# Altium schematic sheet Licznik_sekund.SchDoc
size A4; SheetNumber: 2; SheetTotal: 8
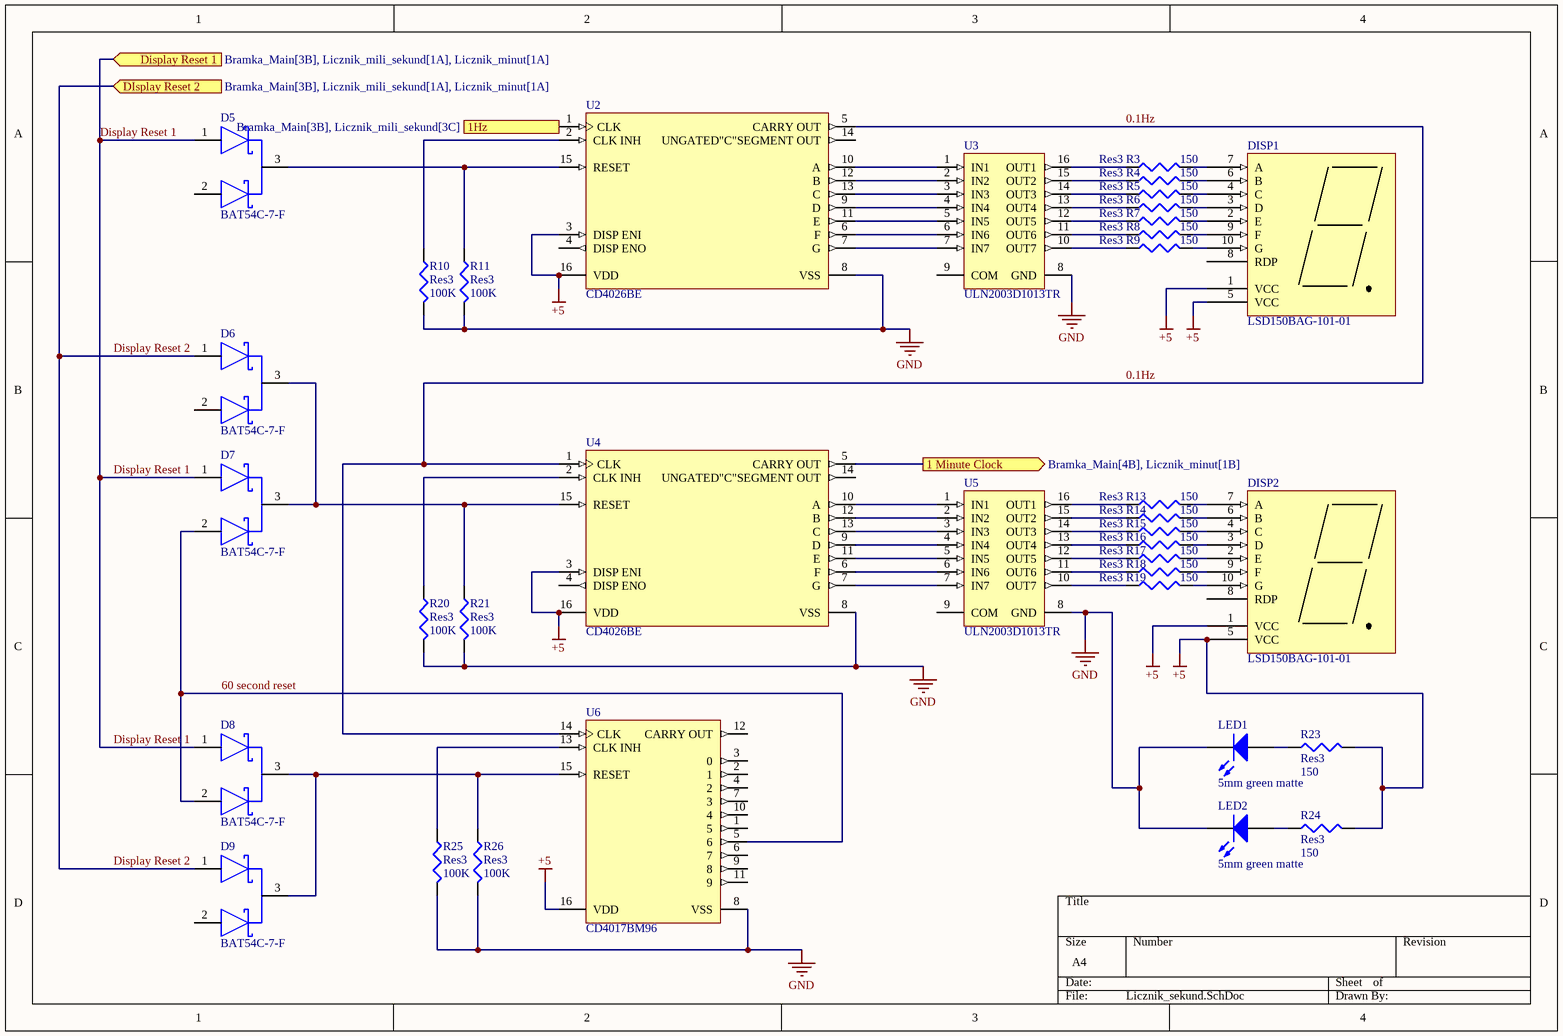
[diagram p0: Licznik_sekund.SchDoc]

## Parts
D5  BAT54C-7-F  [FP-SOT23-IPC_B]
D6  BAT54C-7-F  [FP-SOT23-IPC_B]
D7  BAT54C-7-F  [FP-SOT23-IPC_B]
D8  BAT54C-7-F  [FP-SOT23-IPC_B]
D9  BAT54C-7-F  [FP-SOT23-IPC_B]
DISP1  LSD150BAG-101-01  [7 segment display]
DISP2  LSD150BAG-101-01  [7 segment display]
LED1  5mm green matte  [Type 5mm]
LED2  5mm green matte  [Type 5mm]
R3  Res3  value 150  [6-0805_M]
R4  Res3  value 150  [6-0805_M]
R5  Res3  value 150  [6-0805_M]
R6  Res3  value 150  [6-0805_M]
R7  Res3  value 150  [6-0805_M]
R8  Res3  value 150  [6-0805_M]
R9  Res3  value 150  [6-0805_M]
R10  Res3  value 100K  [J1-0603]
R11  Res3  value 100K  [J1-0603]
R13  Res3  value 150  [6-0805_M]
R14  Res3  value 150  [6-0805_M]
R15  Res3  value 150  [6-0805_M]
R16  Res3  value 150  [6-0805_M]
R17  Res3  value 150  [6-0805_M]
R18  Res3  value 150  [6-0805_M]
R19  Res3  value 150  [6-0805_M]
R20  Res3  value 100K  [J1-0603]
R21  Res3  value 100K  [J1-0603]
R23  Res3  value 150  [6-0805_M]
R24  Res3  value 150  [6-0805_M]
R25  Res3  value 100K  [J1-0603]
R26  Res3  value 100K  [J1-0603]
U2  CD4026BE  [N0016A]
U3  ULN2003D1013TR  [STM-SO-16_M]
U4  CD4026BE  [N0016A]
U5  ULN2003D1013TR  [STM-SO-16_M]
U6  CD4017BM96  [D0016A_L]

## Ports
1 Minute Clock (out, see Bramka_Main[4B], Licznik_minut[1B]), 1Hz (in, see Bramka_Main[3B], Licznik_mili_sekund[3C]), Display Reset 1 (in, see Bramka_Main[3B], Licznik_mili_sekund[1A], Licznik_minut[1A]), DIsplay Reset 2 (in, see Bramka_Main[3B], Licznik_mili_sekund[1A], Licznik_minut[1A])

## Nets
+5: DISP1.1(VCC) DISP1.5(VCC) DISP2.1(VCC) DISP2.5(VCC) R23.2 R24.2 U2.3(DISP_ENI) U2.16(VDD) U4.3(DISP_ENI) U4.16(VDD) U6.16(VDD)
GND: LED1.1(K) LED2.1(K) R10.2 R11.2 R20.2 R21.2 R25.2 R26.2 U2.8(VSS) U3.8(GND) U4.8(VSS) U5.8(GND) U6.8(VSS)
0.1Hz: U2.5(CARRY_OUT) U4.1(CLK) U6.14(CLK)
1 Minute Clock: U4.5(CARRY_OUT) ; port 1 Minute Clock
1Hz: U2.1(CLK) ; port 1Hz
60 second reset: D7.2(2_ANODE) D8.2(2_ANODE) U6.5(6)
Display Reset 1: D5.1(1_ANODE) D7.1(1_ANODE) D8.1(1_ANODE) ; port Display Reset 1
Display Reset 2: D6.1(1_ANODE) D9.1(1_ANODE) ; port DIsplay Reset 2
NetD5_3: D5.3(COMMON_CATHODE) R11.1 U2.15(RESET)
NetD6_3: D6.3(COMMON_CATHODE) D7.3(COMMON_CATHODE) R21.1 U4.15(RESET)
NetD8_3: D8.3(COMMON_CATHODE) D9.3(COMMON_CATHODE) R26.1 U6.15(RESET)
NetDISP1_2: DISP1.2(E) R7.2
NetDISP1_3: DISP1.3(D) R6.2
NetDISP1_4: DISP1.4(C) R5.2
NetDISP1_6: DISP1.6(B) R4.2
NetDISP1_7: DISP1.7(A) R3.2
NetDISP1_9: DISP1.9(F) R8.2
NetDISP1_10: DISP1.10(G) R9.2
NetDISP2_2: DISP2.2(E) R17.2
NetDISP2_3: DISP2.3(D) R16.2
NetDISP2_4: DISP2.4(C) R15.2
NetDISP2_6: DISP2.6(B) R14.2
NetDISP2_7: DISP2.7(A) R13.2
NetDISP2_9: DISP2.9(F) R18.2
NetDISP2_10: DISP2.10(G) R19.2
NetLED1_2: LED1.2(A) R23.1
NetLED2_2: LED2.2(A) R24.1
NetR3_1: R3.1 U3.16(OUT1)
NetR4_1: R4.1 U3.15(OUT2)
NetR5_1: R5.1 U3.14(OUT3)
NetR6_1: R6.1 U3.13(OUT4)
NetR7_1: R7.1 U3.12(OUT5)
NetR8_1: R8.1 U3.11(OUT6)
NetR9_1: R9.1 U3.10(OUT7)
NetR10_1: R10.1 U2.2(CLK_INH)
NetR13_1: R13.1 U5.16(OUT1)
NetR14_1: R14.1 U5.15(OUT2)
NetR15_1: R15.1 U5.14(OUT3)
NetR16_1: R16.1 U5.13(OUT4)
NetR17_1: R17.1 U5.12(OUT5)
NetR18_1: R18.1 U5.11(OUT6)
NetR19_1: R19.1 U5.10(OUT7)
NetR20_1: R20.1 U4.2(CLK_INH)
NetR25_1: R25.1 U6.13(CLK_INH)
NetU2_6: U2.6(F) U3.6(IN6)
NetU2_7: U2.7(G) U3.7(IN7)
NetU2_9: U2.9(D) U3.4(IN4)
NetU2_10: U2.10(A) U3.1(IN1)
NetU2_11: U2.11(E) U3.5(IN5)
NetU2_12: U2.12(B) U3.2(IN2)
NetU2_13: U2.13(C) U3.3(IN3)
NetU4_6: U4.6(F) U5.6(IN6)
NetU4_7: U4.7(G) U5.7(IN7)
NetU4_9: U4.9(D) U5.4(IN4)
NetU4_10: U4.10(A) U5.1(IN1)
NetU4_11: U4.11(E) U5.5(IN5)
NetU4_12: U4.12(B) U5.2(IN2)
NetU4_13: U4.13(C) U5.3(IN3)

Not connected (* = marked no-connect by the designer): D5 2(2_ANODE); D6 2(2_ANODE); D9 2(2_ANODE); DISP1 8(RDP); DISP2 8(RDP); U2 4(DISP_ENO) 14(UNGATED"C"SEGMENT_OUT); U3 9(COM); U4 4(DISP_ENO) 14(UNGATED"C"SEGMENT_OUT); U5 9(COM); U6 1(5) 2(1) 3(0) 4(2) 6(7) 7(3) 9(8) 10(4) 11(9) 12(CARRY_OUT)

## Library data of the parts
D5-D9 = CMP-12790-000084-1: DIODE ARRAY SCHOTTKY 30V SOT23-3; Max Reverse Current: 2uA; Power Dissipation: 200mW; Average Rectified Current: 200mA; Capacitance: 10pF; Peak Non-Repetitive Surge Current: 600mA; Forward Voltage: 800mV; Reverse Recovery Time: 5ns; Element Configuration: Common Cathode; Max Operating Temperature: 150°C; Max Reverse Voltage (DC): 30V; Power Rating: 200mW; Termination: SMD/SMT; REACH SVHC: No SVHC; Voltage Rating (DC): 30V; Series: -; Current Rating: 200mA; RoHS Compliant: Yes; Max Power Dissipation: 200mW; Case/Package: SOT-23; Max Repetitive Reverse Voltage (Vrrm): 30V; Width: 1.3mm; Min Operating Temperature: -65°C; Lead Free: Lead Free; Forward Current: 200mA; Number of Pins: 3; Contact Plating: Tin; Package Quantity: 3000; Length: 2.9mm; Radiation Hardening: No; Max Forward Surge Current (Ifsm): 600mA; Height: 1mm; Packaging: Tape and Reel; Mount: Surface Mount; Weight: 0.000282oz
DISP1 DISP2 = CMP-007-00036-2: 7 segment display 1.5 inch
LED1 LED2 = CMP-1488-00007-1: THT LED round mono-color color lens, WL-TMRW, Bright Green; PartNumber: 151051VS04000; Manufacturer: Wuerth Elektronik; Emitting color: Bright Green; ComponentLink1Description: Manufacturer URL; PackageReference: Type 5mm; ComponentLink2URL: http://katalog.we-online.de/pbs/datasheet/7448042001.pdfhttp://katalog.we-online.de/pbs/datasheet/7448042001.pdfhttp://katalog.we-online.de/pbs/datasheet/7448042001.pdfhttp://katalog.we-online.de/pbs/datasheet/151051VS04000.pdf; ComponentLink1URL: http://www.we-online.com; ComponentLink2Description: Datasheet
R3-R11 R13-R21 R23-R26 = Res3: Resistor; Published: 8-Jun-2000; LatestRevisionDate: 29-May-2009; LatestRevisionNote: IPC-7351 Footprint Added.; PackageReference: J1-0603; Publisher: Altium Limited; PackageDescription: Chip Resistor
U2 U4 = CMP-1623-00561-2: CMOS Decade Counter/Divider with Decoded 7-Segment Display Outputs and Display Enable, N0016A, TUBE; Manufacturer: Texas Instruments; ICC @ Nom Voltage(Max)(mA): 0.03; tpd @ Nom Voltage(Max)(ns): 250; F @ Nom Voltage(Max)(Mhz): 8; Bits(#): 7; VCC(Max)(V): 18; VCC(Min)(V): 3; Output Drive (IOL/IOH)(Max)(mA): 1.5/-1.5; Inputs: 1; Rating: Catalog; Technology Family: CD4000; Schmitt Trigger: No; Voltage(Nom)(V): 5,10,15; DatasheetVersion: SCHS031B; Operating Temperature Range(C): -55 to 125; Code_JEDEC: MS-001; Input Type: CMOS; Output Type: CMOS; Type: Decade; Generic Part Number: CD4026B; PackageReference: N0016A; Function: Counter
U3 U5 = CMP-2000-05374-1: Seven NPN Darlington Array Transistor, 50 V, 500 mA, -40 to 85 degC, 8-Pin SOIC, RoHS, Tape and Reel; Manufacturer: STMicroelectronics; Collector Emitter Voltage V(br)ceo: 50V; SVHC: NoSVHC(17-Dec-2015); DC Current Gain hFE: 1000hFE; DC Collector Current: 500mA; No. of Pins: 16Pins; Package Reference: SO-16; Transistor Polarity: NPN; Transistor Case Style: SOIC; Datasheet URL: https://datasheet.ciiva.com/1193/1690348-1193460.pdf; Package Description: 16-Pin Small Outline Integrated Circuit, Body 9.9 x 3.9 mm, Pitch 1.27 mm; Datasheet Version: Rev. 8, 06/2012; Power Dissipation Pd: -; Product Range: -; Operating Temperature Max: 85degC; MSL: MSL1-Unlimited; Manufacturer URL: http://www.st.com/; Automotive Qualification Standard: -
U6 = CMP-1623-00072-2: CMOS Decade Counter with 10 Decoded Outputs, D0016A, LARGE T&R; Manufacturer: Texas Instruments; Technology Family: CD4000; Schmitt Trigger: No; VCC(Max)(V): 18; Inputs: 1; tpd @ Nom Voltage(Max)(ns): 270; Rating: Military; Bits(#): 10; Output Drive (IOL/IOH)(Max)(mA): 1.5/-1.5; ICC @ Nom Voltage(Max)(mA): 0.03; F @ Nom Voltage(Max)(Mhz): 8; VCC(Min)(V): 3; Output Type: CMOS; Operating Temperature Range(C): -55 to 125; Generic Part Number: CD4017B; Type: Decade; DatasheetVersion: SCHS027C; Input Type: CMOS; Function: Counter; PackageReference: D0016A; Code_JEDEC: MS-012 variation AC; Voltage(Nom)(V): 10